# Altium schematic sheet OSPLC2_2_IO1.SchDoc
size 294 x 198 mm
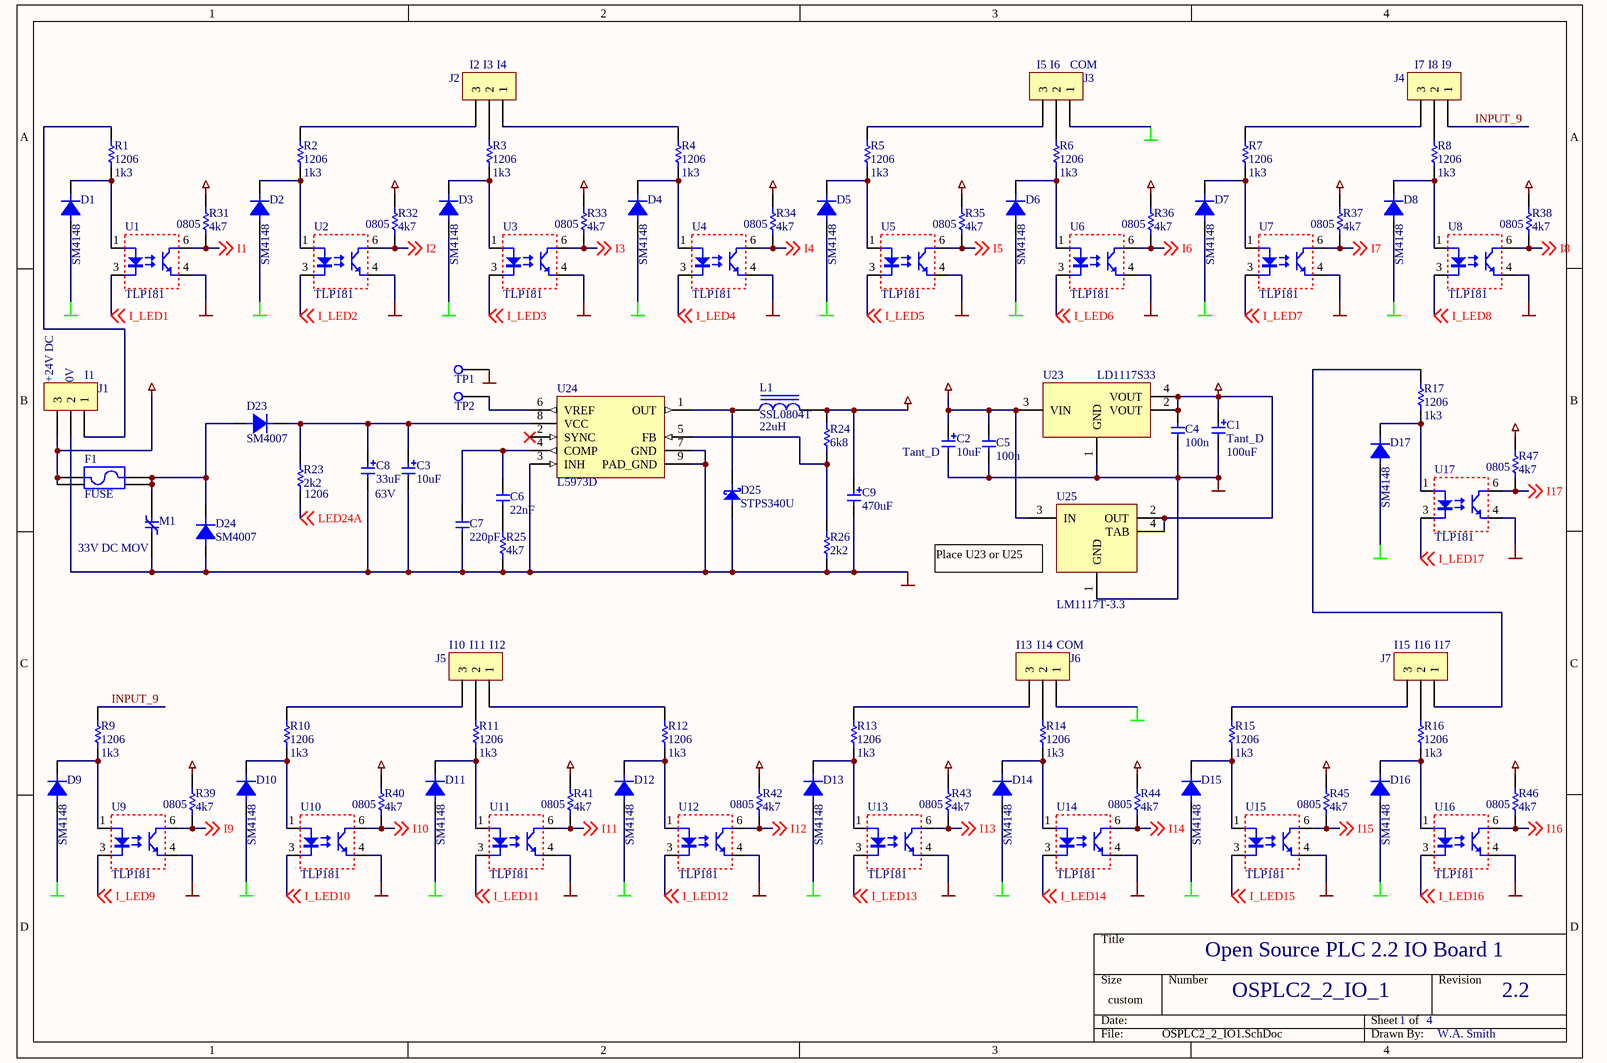
[diagram p0: OSPLC2_2_IO1.SchDoc]

## Parts
C1  Tant_D  value 100uF  [CAP_TANT_D]
C2  Tant_D  value 10uF  [CAP_TANT_D]
C3  value 10uF  [CAP_100_RP]  (hidden comment: CAP_100_RP)
C4  value 100n  [0805]  (hidden comment: 0805)
C5  value 100n  [0805]  (hidden comment: 0805)
C6  value 22nF  [0805]  (hidden comment: 0805)
C7  value 220pF  [0805]  (hidden comment: 0805)
C8  63V  value 33uF  [CAP_100_RP]
C9  value 470uF  [CAP_200_RP]  (hidden comment: CAP_200_RP)
D1  SM4148  [MELF-R2/X1.6]
D2  SM4148  [MELF-R2/X1.6]
D3  SM4148  [MELF-R2/X1.6]
D4  SM4148  [MELF-R2/X1.6]
D5  SM4148  [MELF-R2/X1.6]
D6  SM4148  [MELF-R2/X1.6]
D7  SM4148  [MELF-R2/X1.6]
D8  SM4148  [MELF-R2/X1.6]
D9  SM4148  [MELF-R2/X1.6]
D10  SM4148  [MELF-R2/X1.6]
D11  SM4148  [MELF-R2/X1.6]
D12  SM4148  [MELF-R2/X1.6]
D13  SM4148  [MELF-R2/X1.6]
D14  SM4148  [MELF-R2/X1.6]
D15  SM4148  [MELF-R2/X1.6]
D16  SM4148  [MELF-R2/X1.6]
D17  SM4148  [MELF-R2/X1.6]
D23  SM4007  [MELF-2.2x2.5]
D24  SM4007  [MELF-2.2x2.5]
D25  STPS340U  [STPS2L25U]
F1  FUSE  [FUSE_MULT]
J1  PCB TERMINAL  [TERMINAL_3WAY_5MM]  (value not drawn)
J2  PCB TERMINAL  [TERMINAL_3WAY_5MM]  (value not drawn)
J3  PCB TERMINAL  [TERMINAL_3WAY_5MM]  (value not drawn)
J4  PCB TERMINAL  [TERMINAL_3WAY_5MM]  (value not drawn)
J5  PCB TERMINAL  [TERMINAL_3WAY_5MM]  (value not drawn)
J6  PCB TERMINAL  [TERMINAL_3WAY_5MM]  (value not drawn)
J7  PCB TERMINAL  [TERMINAL_3WAY_5MM]  (value not drawn)
L1  SSL0804T  [SSL0804]
M1  33V DC MOV  [MOV_7.6mm]
R1  1206  value 1k3  [1206]
R2  1206  value 1k3  [1206]
R3  1206  value 1k3  [1206]
R4  1206  value 1k3  [1206]
R5  1206  value 1k3  [1206]
R6  1206  value 1k3  [1206]
R7  1206  value 1k3  [1206]
R8  1206  value 1k3  [1206]
R9  1206  value 1k3  [1206]
R10  1206  value 1k3  [1206]
R11  1206  value 1k3  [1206]
R12  1206  value 1k3  [1206]
R13  1206  value 1k3  [1206]
R14  1206  value 1k3  [1206]
R15  1206  value 1k3  [1206]
R16  1206  value 1k3  [1206]
R17  1206  value 1k3  [1206]
R23  1206  value 2k2  [1206]
R24  value 6k8  [0805]  (hidden comment: 0805)
R25  value 4k7  [0805]  (hidden comment: 0805)
R26  value 2k2  [0805]  (hidden comment: 0805)
R31  0805  value 4k7  [0805]
R32  0805  value 4k7  [0805]
R33  0805  value 4k7  [0805]
R34  0805  value 4k7  [0805]
R35  0805  value 4k7  [0805]
R36  0805  value 4k7  [0805]
R37  0805  value 4k7  [0805]
R38  0805  value 4k7  [0805]
R39  0805  value 4k7  [0805]
R40  0805  value 4k7  [0805]
R41  0805  value 4k7  [0805]
R42  0805  value 4k7  [0805]
R43  0805  value 4k7  [0805]
R44  0805  value 4k7  [0805]
R45  0805  value 4k7  [0805]
R46  0805  value 4k7  [0805]
R47  0805  value 4k7  [0805]
TP1  TEST POINT  [TEST_POINT_TH]  (value not drawn)
TP2  TEST POINT  [TEST_POINT_TH]  (value not drawn)
U1  TLP181  [SOP4_2.54]
U2  TLP181  [SOP4_2.54]
U3  TLP181  [SOP4_2.54]
U4  TLP181  [SOP4_2.54]
U5  TLP181  [SOP4_2.54]
U6  TLP181  [SOP4_2.54]
U7  TLP181  [SOP4_2.54]
U8  TLP181  [SOP4_2.54]
U9  TLP181  [SOP4_2.54]
U10  TLP181  [SOP4_2.54]
U11  TLP181  [SOP4_2.54]
U12  TLP181  [SOP4_2.54]
U13  TLP181  [SOP4_2.54]
U14  TLP181  [SOP4_2.54]
U15  TLP181  [SOP4_2.54]
U16  TLP181  [SOP4_2.54]
U17  TLP181  [SOP4_2.54]
U23  LD1117S33  [SOT-223]
U24  L5973D  [HSOP8]
U25  LM1117T-3.3  [TO-220_H]

## Nets
GND: C1.2 C2.2 C3.2 C4.2 C5.2 C7.1 C8.2 C9.2 D24.1(A) D25.2(A) J1.2 M1.1 R25.1 R26.1 TP1.1 U1.4 U2.4 U3.4 U4.4 U5.4 U6.4 U7.4 U8.4 U9.4 U10.4 U11.4 U12.4 U13.4 U14.4 U15.4 U16.4 U17.4 U23.1(GND) U24.3(INH) U24.7(GND) U24.9(PAD_GND) U25.1(GND)
IN_GND: D1.1(A) D2.1(A) D3.1(A) D4.1(A) D5.1(A) D6.1(A) D7.1(A) D8.1(A) D9.1(A) D10.1(A) D11.1(A) D12.1(A) D13.1(A) D14.1(A) D15.1(A) D16.1(A) D17.1(A) J3.1 J6.1
VCC3v3: C1.1 C4.1 R31.2 R32.2 R33.2 R34.2 R35.2 R36.2 R37.2 R38.2 R39.2 R40.2 R41.2 R42.2 R43.2 R44.2 R45.2 R46.2 R47.2 U23.2(VOUT) U23.4(VOUT) U25.2(OUT) U25.4(TAB)
VCC5: C2.1 C5.1 C9.1 L1.2 R24.2 U23.3(VIN) U25.3(IN)
VCC24: F1.1 F1.3 J1.3
I1: R31.1 U1.6 ; off-sheet I1
I2: R32.1 U2.6 ; off-sheet I2
I3: R33.1 U3.6 ; off-sheet I3
I4: R34.1 U4.6 ; off-sheet I4
I5: R35.1 U5.6 ; off-sheet I5
I6: R36.1 U6.6 ; off-sheet I6
I7: R37.1 U7.6 ; off-sheet I7
I8: R38.1 U8.6 ; off-sheet I8
I9: R39.1 U9.6 ; off-sheet I9
I10: R40.1 U10.6 ; off-sheet I10
I11: R41.1 U11.6 ; off-sheet I11
I12: R42.1 U12.6 ; off-sheet I12
I13: R43.1 U13.6 ; off-sheet I13
I14: R44.1 U14.6 ; off-sheet I14
I15: R45.1 U15.6 ; off-sheet I15
I16: R46.1 U16.6 ; off-sheet I16
I17: R47.1 U17.6 ; off-sheet I17
I_LED1: U1.3 ; off-sheet I_LED1
I_LED2: U2.3 ; off-sheet I_LED2
I_LED3: U3.3 ; off-sheet I_LED3
I_LED4: U4.3 ; off-sheet I_LED4
I_LED5: U5.3 ; off-sheet I_LED5
I_LED6: U6.3 ; off-sheet I_LED6
I_LED7: U7.3 ; off-sheet I_LED7
I_LED8: U8.3 ; off-sheet I_LED8
I_LED9: U9.3 ; off-sheet I_LED9
I_LED10: U10.3 ; off-sheet I_LED10
I_LED11: U11.3 ; off-sheet I_LED11
I_LED12: U12.3 ; off-sheet I_LED12
I_LED13: U13.3 ; off-sheet I_LED13
I_LED14: U14.3 ; off-sheet I_LED14
I_LED15: U15.3 ; off-sheet I_LED15
I_LED16: U16.3 ; off-sheet I_LED16
I_LED17: U17.3 ; off-sheet I_LED17
INPUT_9: J4.1 R9.2
LED24A: R23.1 ; off-sheet LED24A
NetC3_1: C3.1 C8.1 D23.2(C) R23.2 U24.8(VCC)
NetC6_1: C6.1 R25.2
NetC6_2: C6.2 C7.2 U24.4(COMP)
NetD1_2: D1.2(C) R1.1 U1.1
NetD2_2: D2.2(C) R2.1 U2.1
NetD3_2: D3.2(C) R3.1 U3.1
NetD4_2: D4.2(C) R4.1 U4.1
NetD5_2: D5.2(C) R5.1 U5.1
NetD6_2: D6.2(C) R6.1 U6.1
NetD7_2: D7.2(C) R7.1 U7.1
NetD8_2: D8.2(C) R8.1 U8.1
NetD9_2: D9.2(C) R9.1 U9.1
NetD10_2: D10.2(C) R10.1 U10.1
NetD11_2: D11.2(C) R11.1 U11.1
NetD12_2: D12.2(C) R12.1 U12.1
NetD13_2: D13.2(C) R13.1 U13.1
NetD14_2: D14.2(C) R14.1 U14.1
NetD15_2: D15.2(C) R15.1 U15.1
NetD16_2: D16.2(C) R16.1 U16.1
NetD17_2: D17.2(C) R17.1 U17.1
NetD23_1: D23.1(A) D24.2(C) F1.2 F1.4 M1.2
NetD25_1: D25.1(C) L1.1 U24.1(OUT)
NetJ1_1: J1.1 R1.2
NetJ2_1: J2.1 R4.2
NetJ2_2: J2.2 R3.2
NetJ2_3: J2.3 R2.2
NetJ3_2: J3.2 R6.2
NetJ3_3: J3.3 R5.2
NetJ4_2: J4.2 R8.2
NetJ4_3: J4.3 R7.2
NetJ5_1: J5.1 R12.2
NetJ5_2: J5.2 R11.2
NetJ5_3: J5.3 R10.2
NetJ6_2: J6.2 R14.2
NetJ6_3: J6.3 R13.2
NetJ7_1: J7.1 R17.2
NetJ7_2: J7.2 R16.2
NetJ7_3: J7.3 R15.2
NetR24_1: R24.1 R26.2 U24.5(FB)
NetTP2_1: TP2.1 U24.6(VREF)

Not connected (* = marked no-connect by the designer): U24 2(SYNC)*

## Notes on the sheet
- (near J2) I2
- (near J2) I3
- (near J2) I4
- (near J3) I5
- (near J3) I6
- (near J3) COM
- (near J4) I7
- (near J4) I8
- (near J4) I9
- (near J1) +24V DC
- (near J1) 0V
- (near J1) I1
- (near U25) Place U23 or U25
- (near J5) I10
- (near J5) I11
- (near J5) I12
- (near J6) I13
- (near J6) I14
- (near J6) COM
- (near J7) I15
- (near J7) I16
- (near J7) I17
- Open Source PLC 2.2 IO Board 1
- OSPLC2_2_IO_1
- 2.2
- 1
- 4
- W.A. Smith
- (in symbol SSL0804T) 22uH

## Library data of the parts
C1 C2 = CAP_TANT_D: Tantalum Capacitor, D package
C3 C8 = CAP_100_RP: Electrolytic cap, 100 mil pitch
C4-C7 = CAP_0805: 0805 footprint non-polarised capacitor
C9 = CAP_200_RP: Radial Electrolytic Capacitor, 200 thou pin spacing
D1-D17 = SM4148: SMT 1N4148 diode; Value: SM4148
D23 D24 = SM4007: 1A, 1000V MELF Rectifier; Value: SM4007
D25 = STPS340U: Power Schottky rectifier, ST
F1 = FUSE_MULTI: Fuse holder or Fuse clips for 20mm fuse; Value: FUSE
J1-J7 = TERMINAL_3WAY_5MM: 5mm spaced PCB terminal, 3 pole
L1 = SSL0804T: Yageo SMD Power Inductor
M1 = MOV_7.6MM: Metal Oxide Varistor
R1-R17 R23 = RES_1206: 1206 footprint resistor
R24-R26 R31-R47 = RES_0805: 0805 footprint resistor
TP1 TP2 = TEST_POINT_TH: Through hole test point
U1-U17 = TLP181: Toshiba Photocoupler; Value: TLP181
U23 = LD1117S33: ST 3.3V LDO regulator
U24 = L5973D: ST 2.5A switch step down switching regulator
U25 = LM1117T-3.3: National  800mA LDO regulator